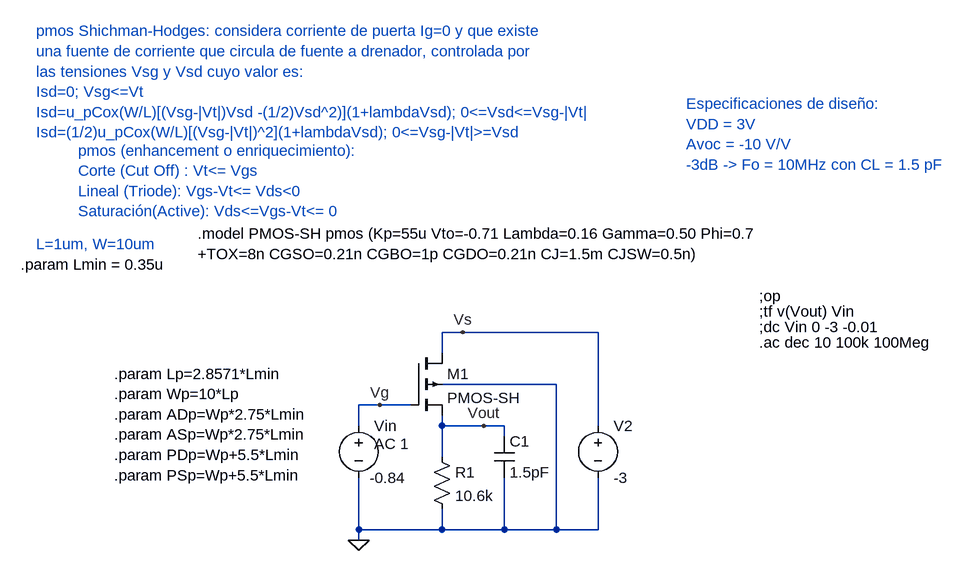
[diagram p0: schematic PMOS_GAIN-STAGE.asc]
PMOS_GAIN-STAGE.asc, the LTspice schematic file:
Version 4
SHEET 1 1348 680
WIRE 576 128 544 128
WIRE 784 128 576 128
WIRE 544 160 544 128
WIRE 720 208 544 208
WIRE 448 240 416 240
WIRE 496 240 448 240
WIRE 416 272 416 240
WIRE 544 272 544 256
WIRE 608 272 544 272
WIRE 640 272 608 272
WIRE 784 272 784 128
WIRE 640 288 640 272
WIRE 544 320 544 272
WIRE 416 432 416 352
WIRE 544 432 544 400
WIRE 544 432 416 432
WIRE 640 432 640 352
WIRE 640 432 544 432
WIRE 720 432 720 208
WIRE 720 432 640 432
WIRE 784 432 784 352
WIRE 784 432 720 432
WIRE 416 448 416 432
FLAG 608 272 Vout
FLAG 448 240 Vg
FLAG 576 128 Vs
FLAG 416 448 0
SYMBOL pmos4 496 160 R0
WINDOW 3 56 69 Left 2
SYMATTR Value PMOS-SH
SYMATTR InstName M1
SYMATTR Value2 l={Lp} w={Wp} ad={ADp} as={ASp} pd={PDp} ps={PSp} m=1
SYMBOL voltage 416 256 R0
WINDOW 3 17 96 Left 2
WINDOW 123 24 44 Left 2
WINDOW 39 0 0 Left 0
SYMATTR Value -0.84
SYMATTR InstName Vin
SYMATTR Value2 AC 1
SYMBOL voltage 784 256 R0
WINDOW 123 0 0 Left 0
WINDOW 39 0 0 Left 0
SYMATTR InstName V2
SYMATTR Value -3
SYMBOL cap 624 288 R0
SYMATTR InstName C1
SYMATTR Value 1.5pF
SYMBOL res 528 304 R0
SYMATTR InstName R1
SYMATTR Value 10.6k
TEXT -80 -8 Left 2 ;L=1um, W=10um
TEXT -16 -152 Left 2 ;pmos (enhancement o enriquecimiento):\nCorte (Cut Off) : Vt<= Vgs\nLineal (Triode): Vgs-Vt<= Vds<0\nSaturación(Active): Vds<=Vgs-Vt<= 0
TEXT -80 -336 Left 2 ;pmos Shichman-Hodges: considera corriente de puerta Ig=0 y que existe\nuna fuente de corriente que circula de fuente a drenador, controlada por\nlas tensiones Vsg y Vsd cuyo valor es:\nIsd=0; Vsg<=Vt\nIsd=u_pCox(W/L)[(Vsg-|Vt|)Vsd -(1/2)Vsd^2)](1+lambdaVsd); 0<=Vsd<=Vsg-|Vt|\nIsd=(1/2)u_pCox(W/L)[(Vsg-|Vt|)^2](1+lambdaVsd); 0<=Vsg-|Vt|>=Vsd
TEXT 168 -24 Left 2 !.model PMOS-SH pmos (Kp=55u Vto=-0.71 Lambda=0.16 Gamma=0.50 Phi=0.7\n+TOX=8n CGSO=0.21n CGBO=1p CGDO=0.21n CJ=1.5m CJSW=0.5n)
TEXT 920 -224 Left 2 ;Especificaciones de diseño:\nVDD = 3V\nAvoc = -10 V/V\n-3dB -> Fo = 10MHz con CL = 1.5 pF
TEXT 40 192 Left 2 !.param Lp=2.8571*Lmin\n.param Wp=10*Lp\n.param ADp=Wp*2.75*Lmin\n.param ASp=Wp*2.75*Lmin\n.param PDp=Wp+5.5*Lmin\n.param PSp=Wp+5.5*Lmin
TEXT -104 24 Left 2 !.param Lmin = 0.35u
TEXT 1032 72 Left 2 !;op
TEXT 1032 96 Left 2 !;tf v(Vout) Vin
TEXT 1032 120 Left 2 !;dc Vin 0 -3 -0.01
TEXT 1032 144 Left 2 !.ac dec 10 100k 100Meg

The netlist it stands for:
* PMOS_GAIN-STAGE.asc
M1 Vs Vg Vout 0 PMOS-SH l={Lp} w={Wp} ad={ADp} as={ASp} pd={PDp} ps={PSp} m=1
Vin Vg 0 -0.84 AC 1
V2 Vs 0 -3
C1 Vout 0 1.5pF
R1 Vout 0 10.6k
.model NMOS NMOS
.model PMOS PMOS
.lib standard.mos
* L=1um, W=10um
* pmos (enhancement o enriquecimiento):
* Corte (Cut Off) : Vt<= Vgs
* Lineal (Triode): Vgs-Vt<= Vds<0
* Saturación(Active): Vds<=Vgs-Vt<= 0
* pmos Shichman-Hodges: considera corriente de puerta Ig=0 y que existe
* una fuente de corriente que circula de fuente a drenador, controlada por
* las tensiones Vsg y Vsd cuyo valor es:
* Isd=0; Vsg<=Vt
* Isd=u_pCox(W/L)[(Vsg-|Vt|)Vsd -(1/2)Vsd^2)](1+lambdaVsd); 0<=Vsd<=Vsg-|Vt|
* Isd=(1/2)u_pCox(W/L)[(Vsg-|Vt|)^2](1+lambdaVsd); 0<=Vsg-|Vt|>=Vsd
.model PMOS-SH pmos (Kp=55u Vto=-0.71 Lambda=0.16 Gamma=0.50 Phi=0.7
+TOX=8n CGSO=0.21n CGBO=1p CGDO=0.21n CJ=1.5m CJSW=0.5n)
* Especificaciones de diseño:
* VDD = 3V
* Avoc = -10 V/V
* -3dB -> Fo = 10MHz con CL = 1.5 pF
.param Lp=2.8571*Lmin
.param Wp=10*Lp
.param ADp=Wp*2.75*Lmin
.param ASp=Wp*2.75*Lmin
.param PDp=Wp+5.5*Lmin
.param PSp=Wp+5.5*Lmin
.param Lmin = 0.35u
;op
;tf v(Vout) Vin
;dc Vin 0 -3 -0.01
.ac dec 10 100k 100Meg
.backanno
.end

* Results of the author's LTspice run, read from the files saved beside the schematic
* Operating Point, zero values left out:
*   V(vs) = -3 V
*   V(vg) = -840 mV
*   V(vout) = -32.86 mV
*   Id(M1) = -3.1 µA
*   Ib(M1) = 3.05 pA
*   Is(M1) = 3.1 µA
*   I(R1) = -3.1 µA
*   I(V2) = 3.1 µA
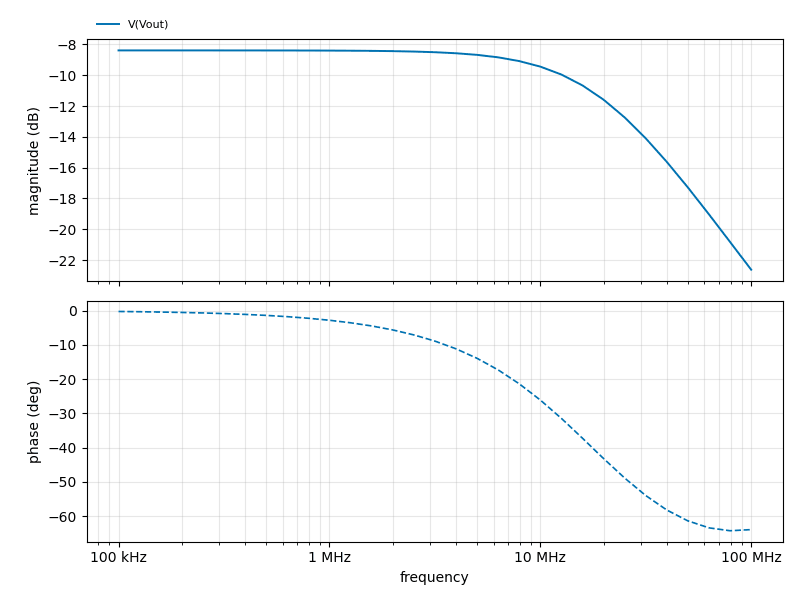
[diagram p1: AC Analysis of PMOS_GAIN-STAGE.asc, plotted from the saved traces]
* AC Analysis, 1 run:
*   V(Vout): -8.39 dB at 100 kHz, -22.63 dB at 100 MHz, peak -8.39 dB at 100 kHz, 3 dB below the peak at 19.04 MHz